# Altium schematic sheet 05-SD_Card.SchDoc: ECE453 Power
size A; Date: 4/25/2017; ApprovedBy: JSK; CheckedBy: JSK; Author: JSK; CompanyName: University of Wisconsin; DrawnBy: JSK; Engineer: JSK; Organization: ECE 315; Address1: College of Engineering; Address2: 1415 Engineering Drive; Address3: Madison, WI 53706; Address4: ECE 453 Fall 2022; Revision: A; SheetNumber: 5; SheetTotal: 10; AssemblyNumber: ECE453-F22-01
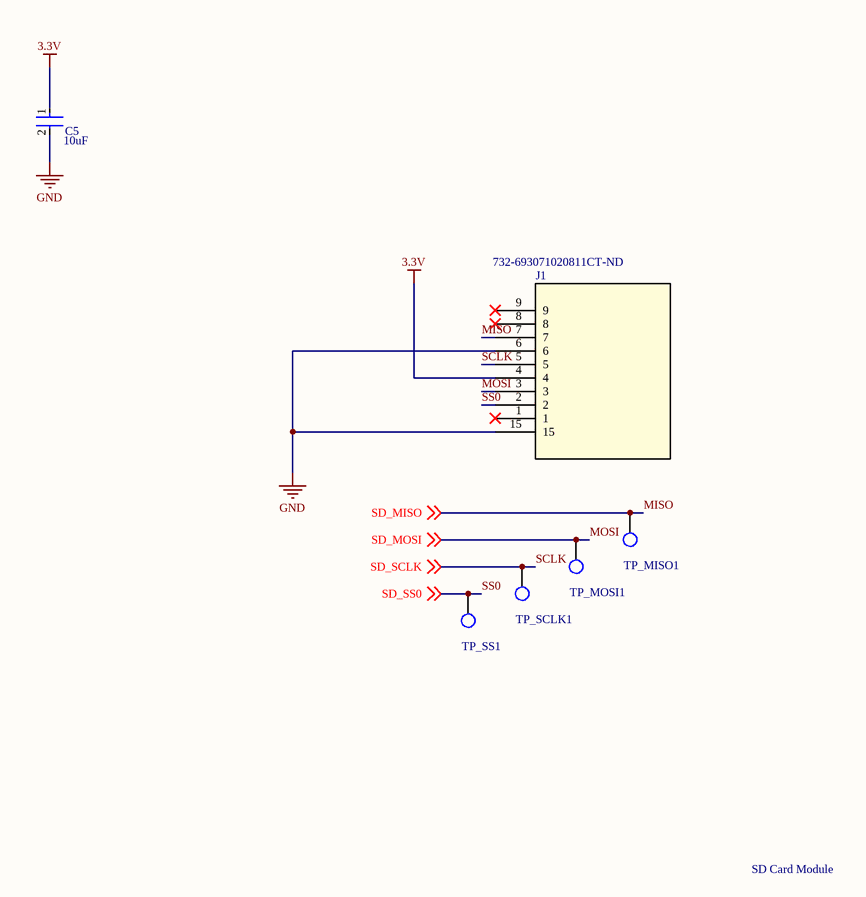
[diagram p0: 05-SD_Card.SchDoc]

## Parts
C5  Capacitance: 10uF  [FP-CL21-IPC_B]  (hidden comment: CL21A106KQCLNNC)
J1  Supplier Part Number 1: 732-693071020811CT-ND  [CONN9_020811_WRE]
TP_MISO1  TP_1206  [TP-SMC-1206]  (value not drawn)
TP_MOSI1  TP_1206  [TP-SMC-1206]  (value not drawn)
TP_SCLK1  TP_1206  [TP-SMC-1206]  (value not drawn)
TP_SS1  TP_1206  [TP-SMC-1206]  (value not drawn)

## Nets
3.3V: C5.1 J1.4
GND: C5.2 J1.6 J1.15
MISO: J1.7 TP_MISO1.1 ; off-sheet SD_MISO  [also labelled SD_MISO]
MOSI: J1.3 TP_MOSI1.1 ; off-sheet SD_MOSI  [also labelled SD_MOSI]
SCLK: J1.5 TP_SCLK1.1 ; off-sheet SD_SCLK  [also labelled SD_SCLK]
SS0: J1.2 TP_SS1.1 ; off-sheet SD_SS0  [also labelled SD_SS0]

Not connected (* = marked no-connect by the designer): J1 1* 8* 9*

## Notes on the sheet
- SD Card Module

## Library data of the parts
C5 = CMP-13271-003047-1: CL21 Series 0805 10uF 6.3V ±10% Tolerance X5R Multilayer Ceramic Chip Capacitor; Lead Free: Lead Free; Mount: Surface Mount; Case/Package: 0805; Packaging: Tape and Reel; Max Operating Temperature: 85°C; Min Operating Temperature: -55°C; Voltage Rating: 6.3V; Case Code (Metric): 2012; Radiation Hardening: No; Tolerance: 10%; Package Quantity: 1; Depth: 1.25mm; Width: 0.049inch; Dielectric: X5R; Height: 0.85mm; Case Code (Imperial): 0805; Length: 2mm; Thickness: 0.037inch
J1 = 693071020811: No Description Available; Mfr_Name: Wurth Electronics; Copyright: Copyright (C) 2022 Ultra Librarian. All rights reserved.; Manufacturer_Part_Number: 693071020811; Digi-Key_Part_Number_1: 732-693071020811TR-ND; Digi-Key_Part_Number_2: 732-693071020811CT-ND; Digi-Key_Part_Number_3: 732-693071020811DKR-ND; RefDes: RefDes; Type: DEV; Supplier 1: Digi-Key
TP_MISO1 TP_MOSI1 TP_SCLK1 TP_SS1 = TP_1206: Test Point SMD 1206; Manufacturer: TE Connectivity (Tyco Electronics); Manufacturer Part Number: 1625854-1; Resistance Value: 0 Ohm; Temperature Coefficient: N/R; Supplier: Digi-Key; Stock 1: 31937; Pricing 1: 1=0.28, 10=0.261, 25=0.224, 50=0.1902, 100=0.1828, 250=0.1641, 500=0.1567, 1000=0.1306 (USD); Case Size: 1206; Dimension: 3.2 x 1.6 x 1.25mm; Family: RC; Mounting: Surface Mount; Operating Temperature: -55 to 125 C; Part No: 1625854-1; RoHS: Yes; Packaging: Tape and Reel; Termination Style: N/R; Terminal Pitch: N/R; Power Rating: N/R; Tolerance: N/R; ComponentLink1URL: https://datasheet.ciiva.com/6439/eng-ds-1773266-a-6439169.pdf; ComponentLink1Description: https://datasheet.ciiva.com/6439/eng-ds-1773266-a-6439169.pdf; ComponentLink2URL: https://datasheet.ciiva.com/30136/1773266-a-30136341.pdf; ComponentLink2Description: https://datasheet.ciiva.com/30136/1773266-a-30136341.pdf; ComponentLink3URL: https://datasheet.ciiva.com/6439/eng-ds-1773266-a-6439080.pdf; ComponentLink3Description: https://datasheet.ciiva.com/6439/eng-ds-1773266-a-6439080.pdf; ComponentLink4URL: https://datasheet.ciiva.com/6439/eng-ds-1773266-a-6439081.pdf; ComponentLink4Description: https://datasheet.ciiva.com/6439/eng-ds-1773266-a-6439081.pdf; ComponentLink5URL: https://datasheet.ciiva.com/6439/eng-ds-1773266-a-6439083.pdf; ComponentLink5Description: https://datasheet.ciiva.com/6439/eng-ds-1773266-a-6439083.pdf; Supplier Part Number: A106143CT-ND; Supplier 1: Digi-Key; Supplier Part Number 1: A106143CT-ND